# Altium schematic sheet fpga-bank2.SchDoc: FPGA - Bank 2
size Legal; CheckedBy: J. Brinton; CompanyName: Signal Laboratories, Inc.; DrawnBy: J. Brinton; Engineer: J. Brinton; Address1: 3479 Edison Way; Address2: Menlo Park CA 94025; Address3: +1 (877) 778-8435; Address4: siglabs.com; DocumentNumber: 29; Revision: 2b; SheetNumber: 30; SheetTotal: 58
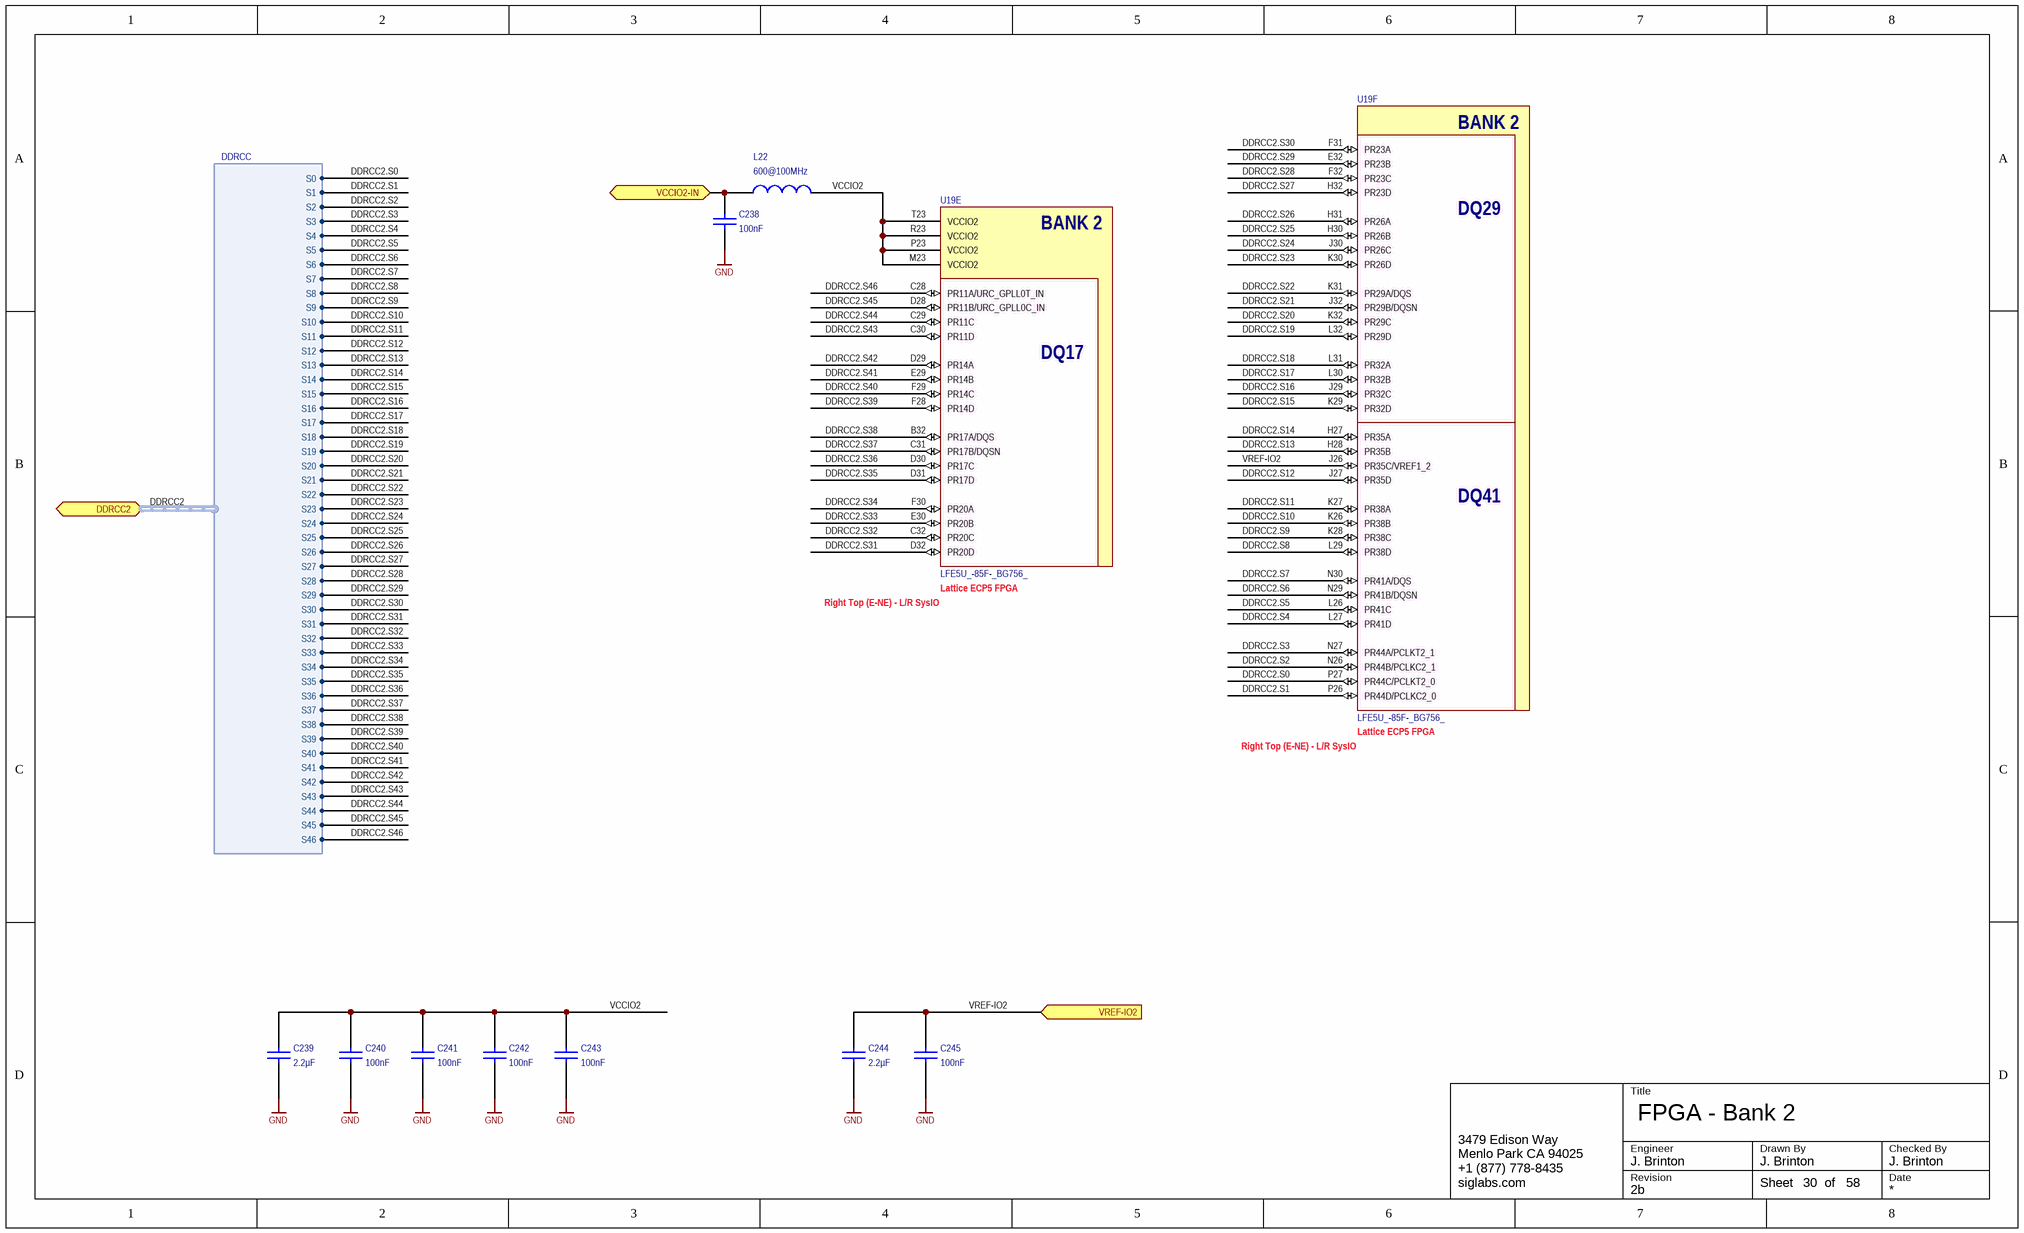
[diagram p0: fpga-bank2.SchDoc]

## Parts
C238  value 100nF  [CAPC1005X56N]  (hidden comment: GRM155R71C104KA88J)
C239  value 2.2µF  [CAPC1608X90N]  (hidden comment: GRM21BR71C225KA12L)
C240  value 100nF  [CAPC1005X56N]  (hidden comment: GRM155R71C104KA88J)
C241  value 100nF  [CAPC1005X56N]  (hidden comment: GRM155R71C104KA88J)
C242  value 100nF  [CAPC1005X56N]  (hidden comment: GRM155R71C104KA88J)
C243  value 100nF  [CAPC1005X56N]  (hidden comment: GRM155R71C104KA88J)
C244  value 2.2µF  [CAPC1608X90N]  (hidden comment: GRM21BR71C225KA12L)
C245  value 100nF  [CAPC1005X56N]  (hidden comment: GRM155R71C104KA88J)
L22  value 600@100MHz  [0402]  (hidden comment: BLM15PX601SN1D)
U19  LFE5U_-85F-_BG756_  [caBGA756]  (parts E,F of 19)

## Ports
DDRCC2 (harness DDRCC), VCCIO2-IN, VREF-IO2 (in)

## Harnesses
DDRCC: S0, S1, S2, S3, S4, S5, S6, S7, S8, S9, S10, S11, S12, S13, S14, S15, S16, S17, S18, S19, S20, S21, S22, S23, S24, S25, S26, S27, S28, S29, S30, S31, S32, S33, S34, S35, S36, S37, S38, S39, S40, S41, S42, S43, S44, S45, S46

## Nets
GND: C238.1 C239.1 C240.1 C241.1 C242.1 C243.1 C244.1 C245.1
DDRCC2.S0: U19.P27(PR44C/PCLKT2_0) ; port DDRCC2.S0
DDRCC2.S1: U19.P26(PR44D/PCLKC2_0) ; port DDRCC2.S1
DDRCC2.S2: U19.N26(PR44B/PCLKC2_1) ; port DDRCC2.S2
DDRCC2.S3: U19.N27(PR44A/PCLKT2_1) ; port DDRCC2.S3
DDRCC2.S4: U19.L27(PR41D) ; port DDRCC2.S4
DDRCC2.S5: U19.L26(PR41C) ; port DDRCC2.S5
DDRCC2.S6: U19.N29(PR41B/DQSN) ; port DDRCC2.S6
DDRCC2.S7: U19.N30(PR41A/DQS) ; port DDRCC2.S7
DDRCC2.S8: U19.L29(PR38D) ; port DDRCC2.S8
DDRCC2.S9: U19.K28(PR38C) ; port DDRCC2.S9
DDRCC2.S10: U19.K26(PR38B) ; port DDRCC2.S10
DDRCC2.S11: U19.K27(PR38A) ; port DDRCC2.S11
DDRCC2.S12: U19.J27(PR35D) ; port DDRCC2.S12
DDRCC2.S13: U19.H28(PR35B) ; port DDRCC2.S13
DDRCC2.S14: U19.H27(PR35A) ; port DDRCC2.S14
DDRCC2.S15: U19.K29(PR32D) ; port DDRCC2.S15
DDRCC2.S16: U19.J29(PR32C) ; port DDRCC2.S16
DDRCC2.S17: U19.L30(PR32B) ; port DDRCC2.S17
DDRCC2.S18: U19.L31(PR32A) ; port DDRCC2.S18
DDRCC2.S19: U19.L32(PR29D) ; port DDRCC2.S19
DDRCC2.S20: U19.K32(PR29C) ; port DDRCC2.S20
DDRCC2.S21: U19.J32(PR29B/DQSN) ; port DDRCC2.S21
DDRCC2.S22: U19.K31(PR29A/DQS) ; port DDRCC2.S22
DDRCC2.S23: U19.K30(PR26D) ; port DDRCC2.S23
DDRCC2.S24: U19.J30(PR26C) ; port DDRCC2.S24
DDRCC2.S25: U19.H30(PR26B) ; port DDRCC2.S25
DDRCC2.S26: U19.H31(PR26A) ; port DDRCC2.S26
DDRCC2.S27: U19.H32(PR23D) ; port DDRCC2.S27
DDRCC2.S28: U19.F32(PR23C) ; port DDRCC2.S28
DDRCC2.S29: U19.E32(PR23B) ; port DDRCC2.S29
DDRCC2.S30: U19.F31(PR23A) ; port DDRCC2.S30
DDRCC2.S31: U19.D32(PR20D) ; port DDRCC2.S31
DDRCC2.S32: U19.C32(PR20C) ; port DDRCC2.S32
DDRCC2.S33: U19.E30(PR20B) ; port DDRCC2.S33
DDRCC2.S34: U19.F30(PR20A) ; port DDRCC2.S34
DDRCC2.S35: U19.D31(PR17D) ; port DDRCC2.S35
DDRCC2.S36: U19.D30(PR17C) ; port DDRCC2.S36
DDRCC2.S37: U19.C31(PR17B/DQSN) ; port DDRCC2.S37
DDRCC2.S38: U19.B32(PR17A/DQS) ; port DDRCC2.S38
DDRCC2.S39: U19.F28(PR14D) ; port DDRCC2.S39
DDRCC2.S40: U19.F29(PR14C) ; port DDRCC2.S40
DDRCC2.S41: U19.E29(PR14B) ; port DDRCC2.S41
DDRCC2.S42: U19.D29(PR14A) ; port DDRCC2.S42
DDRCC2.S43: U19.C30(PR11D) ; port DDRCC2.S43
DDRCC2.S44: U19.C29(PR11C) ; port DDRCC2.S44
DDRCC2.S45: U19.D28(PR11B/URC_GPLL0C_IN) ; port DDRCC2.S45
DDRCC2.S46: U19.C28(PR11A/URC_GPLL0T_IN) ; port DDRCC2.S46
VCCIO2: C239.2 C240.2 C241.2 C242.2 C243.2 L22.1 U19.M23(VCCIO2) U19.P23(VCCIO2) U19.R23(VCCIO2) U19.T23(VCCIO2)
VCCIO2-IN: C238.2 L22.2 ; port VCCIO2-IN
VREF-IO2: C244.2 C245.2 U19.J26(PR35C/VREF1_2) ; port VREF-IO2

## Buses and harness runs
harness DDRCC2 = port DDRCC2

## Notes on the sheet
- (near U19) Right Top (E-NE) - L/R SysIO
- (near U19) Lattice ECP5 FPGA
- Title
- Engineer
- Revision
- Drawn By
- Checked By
- Date
- Sheet
- of
- (in symbol LFE5U_-85F-_BG756_, part E) BANK 2; DQ17
- (in symbol LFE5U_-85F-_BG756_, part F) BANK 2; DQ29; DQ41

## Library data of the parts
C238 C240-C243 C245 = GRM155R71A104KA01J: Ceramic Capacitor 100nF ±10% 16V X7R 0402; Manufacturer: Murata; Tr: -55:125; Manufacturer P/N: GRM155R71C104KA88J; Tolerance: ±10%; Package: 0402; Voltage: 16V
C239 C244 = GRM188R71A225KE15D: Ceramic Capacitor 2.2uF ±10% 10V X7R 0603; Manufacturer: Murata; Tr: -55:125; Manufacturer P/N: GRM188R71A225KE15D; Tolerance: ±10%; Package: 0603; Voltage: 10V
L22 = IND 0402: Ferrite Bead 600-Ohm @ 100MHz 900mA 0402; Manufacturer: Murata; Tolerance: ±25%; Tr: -55:125; Manufacturer P/N: BLM15PX601SN1D; Package: 0402
U19 = LFE5U_-85F-_BG756_: ECP5 FPGA, 85k LUT, 756-caBGA; Manufacturer: Lattice Semiconductor; Manufacturer P/N: LFE5U_-85F-_BG756_